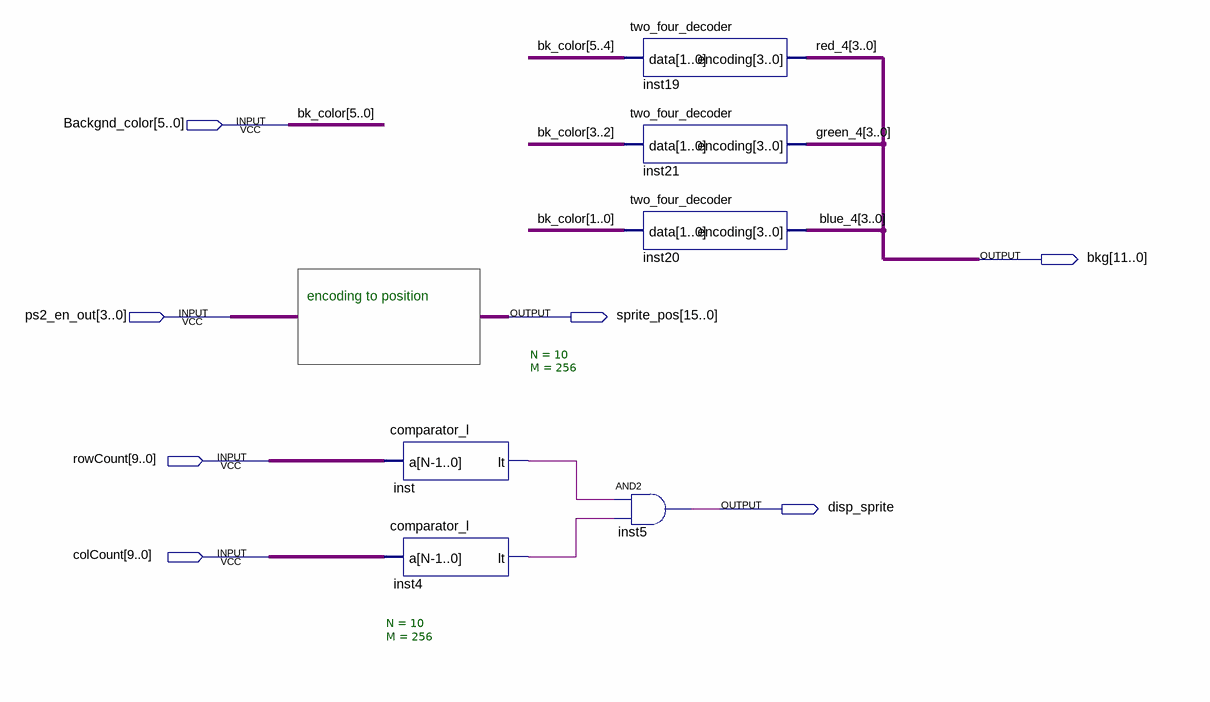
[diagram p0: schematic sheet]
// Quartus schematic Sprite_Position_Parser.bdf as structural Verilog: 6 symbols, 7 pins
module Sprite_Position_Parser (
  input  [5:0] Backgnd_color,
  input  [3:0] ps2_en_out,
  input  [9:0] rowCount,
  input  [9:0] colCount,
  output [11:0] bkg,
  output [15:0] sprite_pos,
  output disp_sprite
);

  wire inst4_lt, inst_lt;
  wire [3:0] blue_4, green_4, red_4;

  comparator_l #(.N(10), .M(256)) inst (.a(rowCount), .lt(inst_lt));
  comparator_l #(.N(10), .M(256)) inst4 (.a(colCount), .lt(inst4_lt));
  two_four_decoder inst19 (.data(Backgnd_color[5:4]), .encoding(red_4));
  two_four_decoder inst21 (.data(Backgnd_color[3:2]), .encoding(green_4));
  two_four_decoder inst20 (.data(Backgnd_color[1:0]), .encoding(blue_4));
  and inst5 (disp_sprite, inst_lt, inst4_lt);

  // Other names for the same wires on the sheet: bk_color[5:0] = Backgnd_color

  // Notes on the sheet:
  //   encoding to position
endmodule
